# Altium schematic sheet PCIe.SchDoc
size A4; SheetNumber: 12; SheetTotal: 13
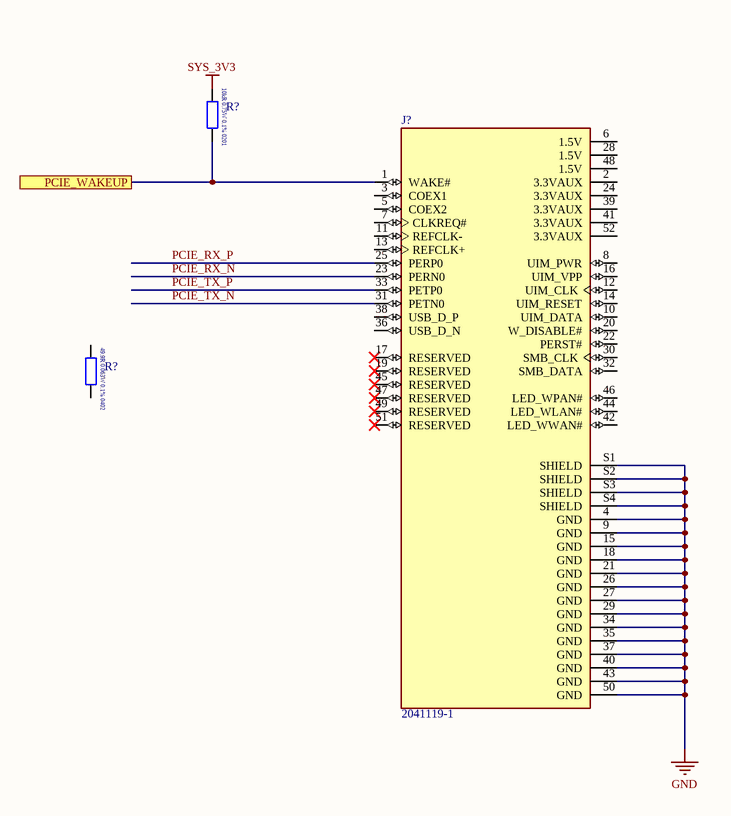
[diagram p0: PCIe.SchDoc]

## Parts
(Parts that share a designator on the sheet are numbered #1, #2 ... from top to bottom, then left to right.)
J?  2041119-1
R?#1  TNPW020110K0BEED  [RESC0603X03N]  (value not drawn)
R?#2  ERA-2AEB49R9X  [RESC1005X04L]  (value not drawn)

## Ports
PCIE_WAKEUP

## Nets
GND: J?.4(GND) J?.9(GND) J?.15(GND) J?.18(GND) J?.21(GND) J?.26(GND) J?.27(GND) J?.29(GND) J?.34(GND) J?.35(GND) J?.37(GND) J?.40(GND) J?.43(GND) J?.50(GND) J?.S1(SHIELD) J?.S2(SHIELD) J?.S3(SHIELD) J?.S4(SHIELD)
SYS_3V3: R?#1.1
PCIE_RX_N: J?.23(PERN0)
PCIE_RX_P: J?.25(PERP0)
PCIE_TX_N: J?.31(PETN0)
PCIE_TX_P: J?.33(PETP0)
PCIE_WAKEUP: J?.1(WAKE#) R?#1.2 ; port PCIE_WAKEUP

Not connected (* = marked no-connect by the designer): J? 2(3.3VAUX) 3(COEX1) 5(COEX2) 6(1.5V) 7(CLKREQ#) 8(UIM_PWR) 10(UIM_DATA) 11(REFCLK-) 12(UIM_CLK) 13(REFCLK+) 14(UIM_RESET) 16(UIM_VPP) 17(RESERVED)* 19(RESERVED)* 20(W_DISABLE#) 22(PERST#) 24(3.3VAUX) 28(1.5V) 30(SMB_CLK) 32(SMB_DATA) 36(USB_D_N) 38(USB_D_P) 39(3.3VAUX) 41(3.3VAUX) 42(LED_WWAN#) 44(LED_WLAN#) 45(RESERVED)* 46(LED_WPAN#) 47(RESERVED)* 48(1.5V) 49(RESERVED)* 51(RESERVED)* 52(3.3VAUX); R?#2 1 2

## Notes on the sheet
- (in symbol ERA-2AEB49R9X) 49.9R 0.063W 0.1% 0402
- (in symbol TNPW020110K0BEED) 10kR 0.75W 0.1% 0201

## Library data of the parts
J? = 2041119-1: mSATA/mini PCI-E 4H Type I G/F; Package: None; Price: None; Availability: Unavailable; MP: 2041119-1; Value: *
R?#1 = TNPW020110K0BEED: 10 kOhms ±0.1% 0.075W Chip Resistor 0201 (0603 Metric) Anti-Sulfur, Automotive AEC-Q200, Moisture Resistant Thin Film
R?#2 = ERA-2AEB49R9X: 49.9 Ohms ±0.1% 0.063W, 1/16W Chip Resistor 0402 (1005 Metric) Automotive AEC-Q200 Thin Film